# EAGLE design RP Sapling (EAGLE 9.5.2)
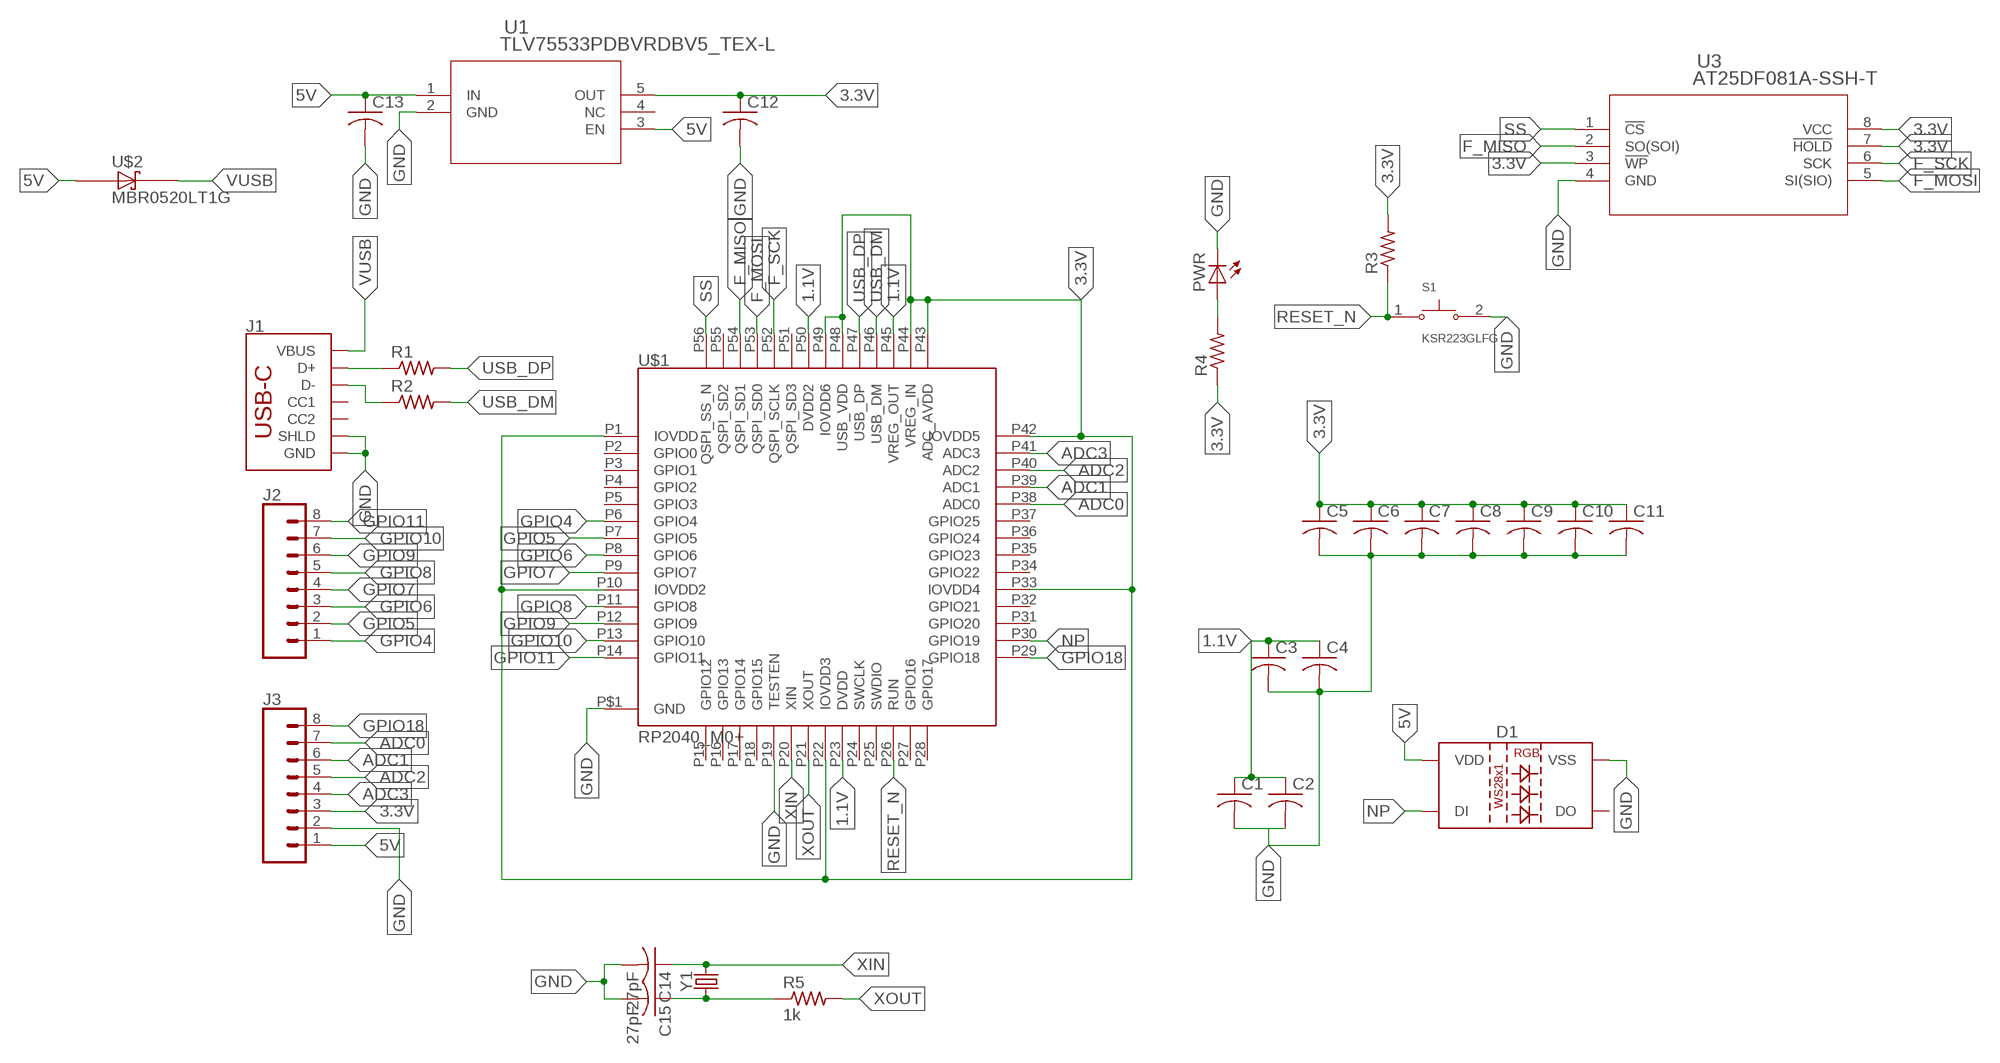
[diagram p0: schematic, sheet 1]

## Parts
C1  C-USC0402  [C0402]
C2  C-USC0402  [C0402]
C3  C-USC0402  [C0402]
C4  C-USC0402  [C0402]
C5  C-USC0402  [C0402]
C6  C-USC0402  [C0402]
C7  C-USC0402  [C0402]
C8  C-USC0402  [C0402]
C9  C-USC0402  [C0402]
C10  C-USC0402  [C0402]
C11  C-USC0402  [C0402]
C12  C-USC0402  [C0402]
C13  C-USC0402  [C0402]
C14  27pF  C-USC0402  [C0402]
C15  27pF  C-USC0402  [C0402]
D1  WS2812BWS2812B-1515  [WS2812B-1515]
J1  USB_C_2-LAYER  [USB-C-16P]
J2  CONN_08NO_SILK_DNP  [1X08_NO_SILK]
J3  CONN_08NO_SILK_DNP  [1X08_NO_SILK]
PWR  LEDCHIPLED_0805  [CHIPLED_0805]
R1  R-US_R0603  [R0603]
R2  R-US_R0603  [R0603]
R3  R-US_R0402  [R0402]
R4  R-US_R0603  [R0603]
R5  1k  R-US_R0402  [R0402]
S1  KSR223GLFG  [SW_KSR223GLFG]
U1  TLV75533PDBVRDBV5_TEX-L  [DBV5_TEX-L]
U3  AT25DF081A-SSH-T  [SOIC_AT25DF081_ADO]
U$1  RP2040_M0+  [QFN-56]
U$2  MBR0520LT1G  [SOD3716X117(SOD-123)]
Y1  CRYSTALSMD-5X3.2-2PAD  [CRYSTAL-SMD-5X3.2-2PAD]

## Nets
1.1V: C1.1 C2.1 C3.1 C4.1 U$1.P23(DVDD) U$1.P45(VREG_OUT) U$1.P50(DVDD2)
3.3V: C5.1 C6.1 C7.1 C8.1 C9.1 C10.1 C11.1 C12.1 J3.3 R3.2 R4.1 U1.5(OUT) U3.3(!WP) U3.7(!HOLD) U3.8(VCC) U$1.P1(IOVDD) U$1.P10(IOVDD2) U$1.P22(IOVDD3) U$1.P33(IOVDD4) U$1.P42(IOVDD5) U$1.P43(ADC_AVDD) U$1.P44(VREG_IN) U$1.P48(USB_VDD) U$1.P49(IOVDD6)
5V: C13.1 D1.VDD J3.1 U1.1(IN) U1.3(EN) U$2.2(A)
ADC0: J3.7 U$1.P38(ADC0)
ADC1: J3.6 U$1.P39(ADC1)
ADC2: J3.5 U$1.P40(ADC2)
ADC3: J3.4 U$1.P41(ADC3)
F_MISO: U3.2(SO(SOI)) U$1.P54(QSPI_SD1)
F_MOSI: U3.5(SI(SIO)) U$1.P53(QSPI_SD0)
F_SCK: U3.6(SCK) U$1.P52(QSPI_SCLK)
GND: C1.2 C2.2 C3.2 C4.2 C5.2 C6.2 C7.2 C8.2 C9.2 C10.2 C11.2 C12.2 C13.2 C14.2 C15.2 D1.GND(VSS) J1.GND J1.GND2(GND) J1.SHLD1(SHLD) J1.SHLD2(SHLD) J1.SHLD3(SHLD) J1.SHLD4(SHLD) J1.SHLD5(SHLD) J1.SHLD6(SHLD) J1.SHLD7(SHLD) J1.SHLD8(SHLD) J3.2 PWR.C S1.2 U1.2(GND) U3.4(GND) U$1.P19(TESTEN) U$1.P$1(GND)
GPIO4: J2.1 U$1.P6(GPIO4)
GPIO5: J2.2 U$1.P7(GPIO5)
GPIO6: J2.3 U$1.P8(GPIO6)
GPIO7: J2.4 U$1.P9(GPIO7)
GPIO8: J2.5 U$1.P11(GPIO8)
GPIO9: J2.6 U$1.P12(GPIO9)
GPIO10: J2.7 U$1.P13(GPIO10)
GPIO11: J2.8 U$1.P14(GPIO11)
GPIO18: J3.8 U$1.P29(GPIO18)
N$3: PWR.A R4.2
N$7: C15.1 R5.1 Y1.P$1
N$8: J1.A6(D+) J1.B6(D+) R1.1
N$9: J1.A7(D-) J1.B7(D-) R2.1
NP: D1.DIN(DI) U$1.P30(GPIO19)
RESET_N: R3.1 S1.1 U$1.P26(RUN)
SS: U3.1(!CS) U$1.P56(QSPI_SS_N)
USB_DM: R2.2 U$1.P46(USB_DM)
USB_DP: R1.2 U$1.P47(USB_DP)
VUSB: J1.VBUS1(VBUS) J1.VBUS2(VBUS) U$2.1(C)
XIN: C14.1 U$1.P20(XIN) Y1.P$2
XOUT: R5.2 U$1.P21(XOUT)
Unconnected: D1.DOUT(DO) J1.A5(CC1) J1.B5(CC2) U1.4(NC) U$1.P2(GPIO0) U$1.P3(GPIO1) U$1.P4(GPIO2) U$1.P5(GPIO3) U$1.P15(GPIO12) U$1.P16(GPIO13) U$1.P17(GPIO14) U$1.P18(GPIO15) U$1.P24(SWCLK) U$1.P25(SWDIO) U$1.P27(GPIO16) U$1.P28(GPIO17) U$1.P31(GPIO20) U$1.P32(GPIO21) U$1.P34(GPIO22) U$1.P35(GPIO23) U$1.P36(GPIO24) U$1.P37(GPIO25) U$1.P51(QSPI_SD3) U$1.P55(QSPI_SD2)

## Library data of the parts
C1-C15 = rcl:C-US: CAPACITOR, American symbol; SPICEPREFIX: C
D1 = SparkFun-LED:WS2812B: WS2812B SMD addressable RGB LED 5x5mm SMD LED with built-in controller IC. Color: Red/Green/Blue mC Rating: RGB: 390, 660, 180 mcd Forward Voltage: RGB: 2.0, 3.0, 3.0 V Packages:WS2812B SparkFun Products: Blynk Board - ESP8266 <https://www.sparkfun.com/products/13794>
J1 = SparkFun-Connectors:USB_C: USB Type C 16Pin Connector Super Speed pins not available on the 16-pin purely SMD connector so this part is best for USB 2.0 implementations. D1 and D2 are tied together enabling D+/- no matter which way the cable is plugged into the connector. The two channel configuration pins (CC1/2) are exposed. These are normally connected to ground via 5.1k resistors but can be reconfigured for high current/high power applications.; PROD_ID: CONN-14122
J2 J3 = SparkFun-Connectors:CONN_08: Multi connection point. Often used as Generic Header-pin footprint for 0.1 inch spaced/style header connections On any of the 0.1 inch spaced packages, you can populate with these: Break Away Headers - Straight <https://www.sparkfun.com/products/116> (PRT-00116) Break Away Male Headers - Right Angle <https://www.sparkfun.com/products/553> (PRT-00553) Female Headers <https://www.sparkfun.com/products/115> (PRT-00115) Break Away Headers - Machine Pin <https://www.sparkfun.com/products/117> (PRT-00117) Break Away Female Headers - Swiss Machine Pin <https://www.sparkfun.com/products/743> (PRT-00743) Arduino Stackable Header - 8 Pin <https://www.sparkfun.com/products/9279> (PRT-09279) For SCREWTERMINALS and SPRING TERMINALS visit here: Screw Terimnals on SparkFun.com <https://www.sparkfun.com/search/results?term=Screw+Terminals> (5mm/3.5mm/2.54mm spacing) This device is also useful as a general connection point to wire up your design to another part of your project. Our various solder wires solder well into these plated through hole pads. Hook-Up Wire - Assortment (Stranded, 22 AWG) <https://www.sparkfun.com/products/11375> (PRT-11375) Hook-Up Wire - Assortment (Solid Core, 22 AWG) <https://www.sparkfun.com/products/11367> (PRT-11367) View the entire wire category on our website here <https://www.sparkfun.com/categories/141> Special notes: Molex polarized connector foot print use with SKU : PRT-08231 with associated crimp pins and housings. 1MM SMD Version SKU: PRT-10208 NOTES ON THE VARIANTS LOCK and LOCK_LONGPADS... This footprint was designed to help hold the alignment of a through-hole component (i.e. 6-pin header) while soldering it into place. You may notice that each hole has been shifted either up or down by 0.005 of an inch from it's more standard position (which is a perfectly straight line). This slight alteration caused the pins (the squares in the middle) to touch the edges of the holes. Because they are alternating, it causes a "brace" to hold the component in place. 0.005 has proven to be the perfect amount of "off-center" position when using our standard breakaway headers. Although looks a little odd when you look at the bare footprint, once you have a header in there, the alteration is very hard to notice. Also,if you push a header all the way into place, it is covered up entirely on the bottom side.
PWR = adafruit:LED: LED OSRAM: - CHIPLED LG R971, LG N971, LY N971, LG Q971, LY Q971, LO R971, LY R971 LH N974, LH R974 LS Q976, LO Q976, LY Q976 LO Q996 - Hyper CHIPLED LW Q18S LB Q993, LB Q99A, LB R99A - SideLED LS A670, LO A670, LY A670, LG A670, LP A670 LB A673, LV A673, LT A673, LW A673 LH A674 LY A675 LS A676, LA A676, LO A676, LY A676, LW A676 LS A679, LY A679, LG A679 - Hyper Micro SIDELED® LS Y876, LA Y876, LO Y876, LY Y876 LT Y87S - SmartLED LW L88C, LW L88S LB L89C, LB L89S, LG L890 LS L89K, LO L89K, LY L89K LS L896, LA L896, LO L896, LY L896 - TOPLED LS T670, LO T670, LY T670, LG T670, LP T670 LSG T670, LSP T670, LSY T670, LOP T670, LYG T670 LG T671, LOG T671, LSG T671 LB T673, LV T673, LT T673, LW T673 LH T674 LS T676, LA T676, LO T676, LY T676, LB T676, LH T676, LSB T676, LW T676 LB T67C, LV T67C, LT T67C, LS T67K, LO T67K, LY T67K, LW E67C LS E67B, LA E67B, LO E67B, LY E67B, LB E67C, LV E67C, LT E67C LW T67C LS T679, LY T679, LG T679 LS T770, LO T770, LY T770, LG T770, LP T770 LB T773, LV T773, LT T773, LW T773 LH T774 LS E675, LA E675, LY E675, LS T675 LS T776, LA T776, LO T776, LY T776, LB T776 LHGB T686 LT T68C, LB T68C - Hyper Mini TOPLED® LB M676 - Mini TOPLED Santana® LG M470 LS M47K, LO M47K, LY M47K Source: http://www.osram.convergy.de/
R1-R5 = rcl:R-US_: RESISTOR, American symbol; SPICEPREFIX: R
S1 = KSR223GLFG:KSR223GLFG: Switch Tactile N.O. SPST Round Button Gull Wing 0.01A 32VDC 0.2VA 200000Cycles 2N SMD Automotive T/R; AVAILABILITY: Unavailable; DESCRIPTION: Tactile Switch SPST-NO Top Actuated Surface Mount; MF: C&K; MP: KSR223GLFG; PACKAGE: None; PRICE: None
U1 = TLV75533pdbvr:TLV75533PDBVR; COPYRIGHT: Copyright (C) 2018 Accelerated Designs. All rights reserved; MANUFACTURER_PART_NUMBER: TLV75533PDBVR; SOURCELIBRARY: TI_2019-06-18; VENDOR: Texas Instruments
U3 = AT25DF081A-SSH-T:AT25DF081A-SSH-T; BUILT_BY: EMA_Matt; COPYRIGHT: Copyright (C) 2018 Accelerated Designs. All rights reserved; MANUFACTURER_PART_NUMBER: AT25DF081A-SSH-T; SOURCELIBRARY: Adesto_Technologies_10-16-2019; VENDOR: Adesto Technologies
U$1 = RP2040_M0:RP2040_M0+
U$2 = MBR0520LT1G:MBR0520LT1G: Surface Mount Schottky Power Rectifier Plastic SOD−123 Package; AVAILABILITY: Unavailable; DESCRIPTION: Diode Schottky 20V 500mA Surface Mount SOD-123; MF: ON Semiconductor; MP: MBR0520LT1G; PACKAGE: SOD-123 ON Semiconductor; PRICE: None
Y1 = SparkFun-Clocks:CRYSTAL: Crystals (Generic) These are passive quartz crystals, which can be used as a clock source for a microcontroller. Crystal's are two-terminal devices. They require external "load" capacitors to generate an oscillating signal.

## Board
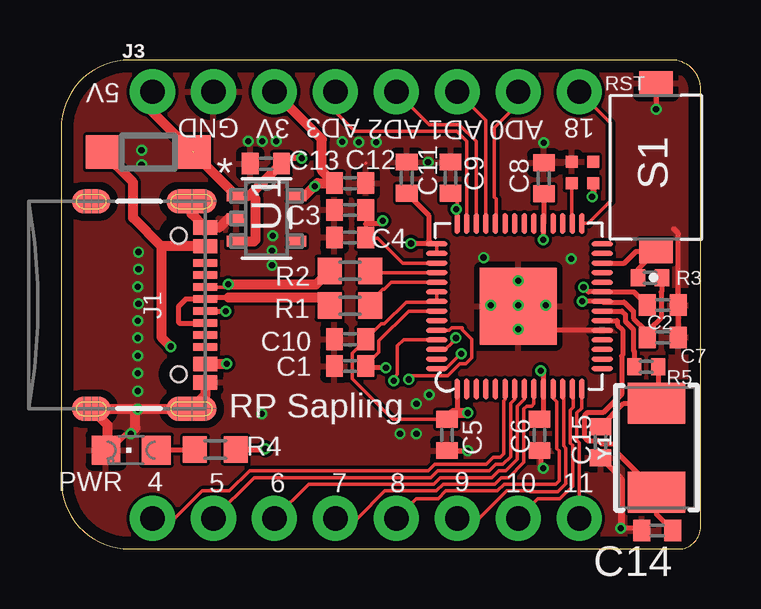
[diagram p1: board, top side]
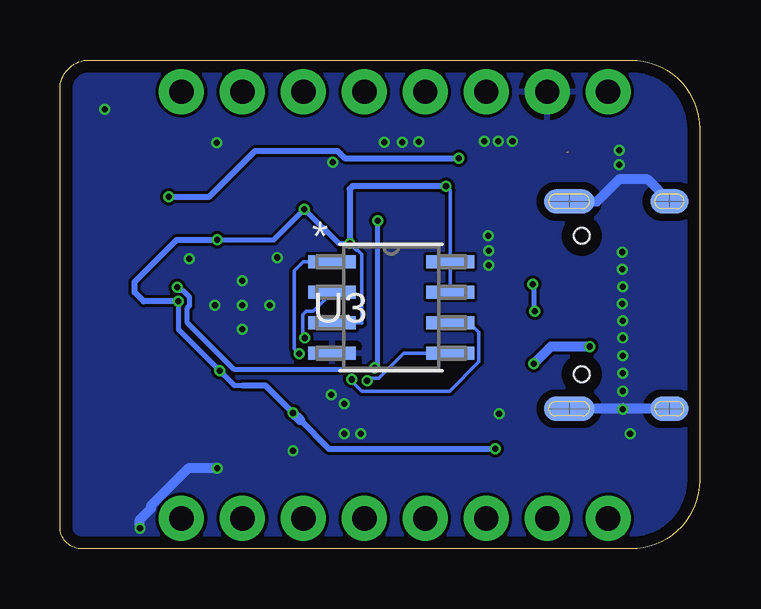
[diagram p2: board, bottom side, seen from below]

Size 26.65 x 20.37 mm. Coordinates in mm from the lower left corner, seen from the top.
Outline: 26.65,0.92 26.65,19.15 arc90 25.43,20.37 2.86,20.37 arc90 0,17.51 0,2.86 arc90 2.86,0 25.73,0 arc90 26.65,0.92
Copper layers (1*16): Top 0.035mm / dielectric 1.5mm / Bottom 0.035mm
Design rules "default *": minimum track width 6mil, minimum drill 10mil, track to track 5mil, track to pad 5mil, pad to pad 5mil, via to via 5mil, smd to smd 5mil, copper to edge 20mil, drill to drill 6mil, minimum pad ring 4mil, minimum via ring 4mil, stop-mask expansion 4mil, vias tented up to drill 10mil, thermal gap 10mil

### Footprints (pad centres in the part's own frame; a part is rotated, then mirrored left to right if it is on the bottom)
C0402 = smd 0.7 x 0.9: 1 -0.65,0; 2 0.65,0
WS2812B-1515 = smd 0.5 x 0.5: DIN -0.9,0.4; DOUT 0,1.3; GND -0.9,1.3; VDD 0,0.4
USB-C-16P = smd 0.3 x 1: A5 -1.25,-0.34; A6 -0.25,-0.34; A7 0.25,-0.34; A8 1.25,-0.34; B5 1.75,-0.34; B6 0.75,-0.34; B7 -0.75,-0.34; B8 -1.75,-0.34 | smd 0.6 x 1: GND -3.225,-0.34; GND2 3.225,-0.34; VBUS1 -2.45,-0.34; VBUS2 2.45,-0.34 | smd 1 x 2.1: SHLD1 -4.32,-0.915; SHLD2 4.32,-0.915 | smd 1 x 2.1 bottom: SHLD3 -4.32,-0.915; SHLD4 4.32,-0.915 | smd 1 x 1.6: SHLD5 -4.32,-5.095; SHLD8 4.32,-5.095 | smd 1 x 1.6 bottom: SHLD6 -4.32,-5.095; SHLD7 4.32,-5.095 | hole 0.65: -2.89,-1.445; 2.89,-1.445
1X08_NO_SILK = drill 1.016 pad 1.88: 1 0,0; 2 2.54,0; 3 5.08,0; 4 7.62,0; 5 10.16,0; 6 12.7,0; 7 15.24,0; 8 17.78,0
CHIPLED_0805 = smd 1.2 x 1.2: A 0,-1.05; C 0,1.05
R0603 = smd 1 x 1.1: 1 -0.85,0; 2 0.85,0
R0402 = smd 0.6 x 0.7: 1 -0.5,0; 2 0.5,0
SW_KSR223GLFG = smd 1 x 1.4: 1 -3.5,0; 2 3.5,0
DBV5_TEX-L = smd 0.775 x 0.457: 1 -1.264,0.95; 2 -1.264,0; 3 -1.264,-0.95; 4 1.264,-0.95; 5 1.264,0.95
SOIC_AT25DF081_ADO = smd 1.981 x 0.559: 1 -2.464,1.905; 2 -2.464,0.635; 3 -2.464,-0.635; 4 -2.464,-1.905; 5 2.464,-1.905; 6 2.464,-0.635; 7 2.464,0.635; 8 2.464,1.905
QFN-56 = smd 0.875 x 0.2: P1 -3.5,2.55; P2 -3.5,2.15; P3 -3.5,1.75; P4 -3.5,1.35; P5 -3.5,0.95; P6 -3.5,0.55; P7 -3.5,0.15; P8 -3.5,-0.25; P9 -3.5,-0.65; P10 -3.5,-1.05; P11 -3.5,-1.45; P12 -3.5,-1.85; P13 -3.5,-2.25; P14 -3.5,-2.65; P29 3.4,-2.65; P30 3.4,-2.25; P31 3.4,-1.85; P32 3.4,-1.45; P33 3.4,-1.05; P34 3.4,-0.65; P35 3.4,-0.25; P36 3.4,0.15; P37 3.4,0.55; P38 3.4,0.95; P39 3.4,1.35; P40 3.4,1.75; P41 3.4,2.15; P42 3.4,2.55 | smd 0.2 x 0.875: P15 -2.65,-3.5; P16 -2.25,-3.5; P17 -1.85,-3.5; P18 -1.45,-3.5; P19 -1.05,-3.5; P20 -0.65,-3.5; P21 -0.25,-3.5; P22 0.15,-3.5; P23 0.55,-3.5; P24 0.95,-3.5; P25 1.35,-3.5; P26 1.75,-3.5; P27 2.15,-3.5; P28 2.55,-3.5; P43 2.55,3.4; P44 2.15,3.4; P45 1.75,3.4; P46 1.35,3.4; P47 0.95,3.4; P48 0.55,3.4; P49 0.15,3.4; P50 -0.25,3.4; P51 -0.65,3.4; P52 -1.05,3.4; P53 -1.45,3.4; P54 -1.85,3.4; P55 -2.25,3.4; P56 -2.65,3.4 | smd 3.2 x 3.2: P$1 -0.05,0
SOD3716X117(SOD-123) = smd 1.4 x 1.4: 1 -1.9,0.051; 2 1.9,0.051
CRYSTAL-SMD-5X3.2-2PAD = smd 1.7 x 2.4: P$1 1.85,0; P$2 -1.85,0

### Placement (x,y rotation side)
C1  12.04,7.62 180 top
C2  25.07,10.16 0 top
C3  12.04,14.12 180 top
C4  12.04,12.98 180 top
C5  16.08,4.75 270 top
C6  19.94,4.75 270 top
C7  25.07,8.81 0 top
C8  20.12,15.44 90 top
C9  16.23,15.47 90 top
C10  12.04,8.74 180 top
C11  14.4,15.47 90 top
C12  12.04,15.24 0 top
C13  8.53,16.05 180 top
C14  24.84,0.76 180 top
C15  22.48,4.45 270 top
D1  22.17,14.83 0 top
J1  6.35,10.16 270 top
J2  3.81,1.27 0 top
J3  3.81,19.05 0 top
PWR  2.92,4.11 90 top
R1  12.04,10.13 0 top
R2  12.04,11.58 0 top
R3  24.54,11.3 0 top
R4  6.43,4.14 180 top
R5  24.38,7.59 180 top
S1  24.79,15.9 90 top
U1  8.56,13.77 0 top
U3  12.85,10.06 0 bottom
U$1  19.05,10.16 90 top
U$2  3.63,16.48 0 top
Y1  24.82,4.22 90 top

### Tracks (layer width: path | path; a pad name or v marks a point on that pad's centre or on a via)
1.1V  (via drill 0.25)
  Top 0.152: C1.1 12.69,7.65 13.24,8.2 13.24,8.67 14.48,9.91 U$1.P50 | U$1.P45 14.23,11.91 13.2,12.93 12.69,12.93 | C3.1 12.69,13.54 C4.1
  Top 0.203: 12.69,12.93 C4.1 | C2.1 23.87,10.71 U$1.P23 21.97,10.71 21.91,10.77 21.89,10.77 v21.77,10.9 | v13.54,7.54 12.77,7.54 C1.1 | v13.41,13.66 13.28,13.54 12.69,13.54
  Bottom 0.203: v21.77,10.9 21.64,10.77 21.53,10.77 21.26,10.5 21.26,10.12 21.36,10.02 21.36,9.45 19.41,7.49 13.59,7.49 v13.54,7.54 13.41,7.67 v13.41,13.66
3.3V  (via drill 0.25)
  Top 0.152: U$1.P48 U$1.P49 15.63,10.29 14.38,10.29 13.47,9.38 13.33,9.38 C10.1 12.69,8.71 12.14,8.15 12.14,7.09 13.82,5.4 C5.1 | C9.1 16.5,14.55 16.5,14.17 U$1.P42 | U$1.P44 U$1.P43
  Top 0.203: C9.1 16.25,14.8 | 20.12,14.55 C8.1 20.12,13.58 U$1.P33 v20.1,12.89 v20.09,12.88 | C6.1 20.1,5.56 U$1.P10 20.1,7.31 v19.99,7.42 | R3.2 25.04,10.74 25,10.7 25,9.62 24.51,9.12 | C7.1 24.42,9.04 24.51,9.12 | 24.51,9.12 24.33,9.12 23.84,9.62 23.84,9.91 23.46,10.29 22.57,10.29 U$1.P22 v21.72,10.31 | C11.1 15.32,13.9 15.32,12.84 15.45,12.71 U$1.P43 15.63,12.72 v14.58,12.72 | 16.5,14.17 v16.48,14.15 v16.47,14.15 | U$1.P1 16.5,5.68 16.48,5.66 | v10.57,15.11 10.69,15.24 C12.1
  Top 0.254: v8.51,4.17 8.48,4.14 R4.1
  Top 0.406: U1.5 10.15,14.72 10.68,15.24 C12.1 10.87,15.76 10.87,17.07 J3.3 | C5.1 16.34,5.66 16.48,5.66 v16.94,5.66
  Bottom 0.152: U3.3 14.1,9.42 14.07,9.4 14.07,12.28 14.24,12.45 14.3,12.45 v14.58,12.72 | U3.7 U3.8 10.39,14.94 v10.57,15.11
  Bottom 0.203: 19.05,6.82 19.39,6.82 v19.99,7.42 21.72,9.14 v21.72,10.31 | v14.58,12.72 15.05,12.72 v16.47,14.15 17.74,12.88 v20.09,12.88
  Bottom 0.254: v21.72,10.31 23.16,10.31 23.55,10.69 23.55,11.12 21.79,12.88 v20.09,12.88 | v10.57,15.11 14.45,15.11 14.58,14.99 v14.58,12.72 | 19.05,6.82 18.1,6.82 v16.94,5.66 | v8.51,4.17 15.44,4.17 16.65,5.37
  Bottom 0.406: 16.65,5.37 v16.94,5.66
5V  (via drill 0.25)  (1 unrouted)
  Top 0.254: 9.29,15.94 C13.1 9.41,16.28 v10.03,16.28 | D1.VDD 22.17,14.73 v22.12,14.68
  Top 0.406: 7.91,14.78 7.85,14.72 U1.1 5.48,16.54 U$2.2 | 7.91,14.78 C13.1 | U1.3 8.04,12.82 8.1,12.88 8.1,14.58 7.91,14.78 | 5.47,16.54 3.81,18.2 J3.1
  Bottom 0.254: v22.12,14.68 20.42,14.68 18.52,16.59 15.09,16.59 14.79,16.28 v10.03,16.28
ADC0
  Top 0.152: J3.7 19.05,18.54 18.06,17.55 18.06,14.66 18.14,14.58 18.14,13.6 U$1.P38
ADC1
  Top 0.152: J3.6 17.7,17.86 U$1.P39
ADC2
  Top 0.152: J3.5 15.34,17.68 16.6,17.68 17.3,16.98 U$1.P40
ADC3
  Top 0.152: U$1.P41 16.9,16.98 16.48,17.4 12.24,17.4 11.43,18.21 J3.4
F_MISO  (via drill 0.25)
  Top 0.152: v16.45,8.79 16.29,8.62 16.29,8.58 16.02,8.31 U$1.P54
  Bottom 0.152: U3.2 16.1,9.91 16.39,9.91 16.54,9.76 16.54,8.87 v16.45,8.79
F_MOSI  (via drill 0.25)
  Top 0.152: U$1.P53 14.27,8.71 14.02,8.46 14.02,7.27 13.86,7.11 v13.86,7.01
  Bottom 0.152: v13.86,7.01 13.86,7.11 13.36,7.11 12.32,8.15 U3.5
F_SCK  (via drill 0.25)
  Top 0.152: v14.49,7.06 14.64,7.21 16.11,7.21 16.61,7.71 16.86,7.71 17.11,7.96 17.11,8.74 16.71,9.14 16.71,9.22 16.27,9.22 16.16,9.11 U$1.P52
  Bottom 0.152: U3.6 9.59,9.42 9.2,9.03 9.2,7.79 10.41,6.58 14.09,6.58 14.49,6.98 v14.49,7.06
GND  (via drill 0.25)  (2 unrouted)
  Top 0.152: D1.GND 21.23,16.09 | C9.2 16.18,16.17 | 14.4,16.26 C11.2 | 12.69,16.07 12.7,16.08 | C10.2 11.36,8.76
  Top 0.203: C5.2 v16.93,4.1 v16.94,4.09 | v20.09,3.35 19.98,3.47 19.98,4.06 C6.2 | C2.2 25.7,10.18 | C2.2 C7.2 | S1.2 v24.79,18.31 | PWR.C 1.93,4.17 2.17,4.42 2.34,4.42 2.72,4.8 v2.9,4.8 | C14.2 24.09,0.86 v23.32,0.86 | U$1.P19 20.1,9.11 v19.05,10.16 | v23.32,0.86 23.39,0.94 23.39,1.42 23.39,2.89 C15.2 23.32,2.96 v23.32,0.86 | C13.2 7.68,16.26 | C2.2 25.72,13.14 25.53,13.34
  Top 0.406: J1.SHLD3 5.43,13.96 J1.GND 6.58,13.38 6.97,13.77 U1.2 | J1.GND2 6.01,6.42 J1.SHLD4 3.12,5.84 | 3.12,5.84 J1.SHLD8 1.93,5.17 1.93,4.17 | v2.9,4.8 2.9,4.83 3.09,5.03 3.09,5.81 3.12,5.84
  Bottom 0.152: 3.17,5.84 3.17,6.03 v3.2,5.82
  Bottom 0.406: v20.09,3.35 21.3,3.35 22.86,1.8 22.86,1.68 23.32,1.22 v23.32,0.86 | J1.SHLD3 4.26,14.48 3.35,15.39 2.17,15.39 J1.SHLD6 | J1.SHLD8 3.17,5.84 J1.SHLD4
  other vias: 19.05,9.14 20.19,10.16 17.91,10.16 19.05,11.18 15.29,16.1 20.12,16.92 14.81,6.05 15.34,6.43 13.13,16.94 12.4,16.94 11.71,16.97 8.97,16.99 8.38,16.99 7.8,16.99 3.35,16.61 3.35,16 3.23,12.37 3.23,11.66 3.2,10.92 3.23,10.21 3.2,9.5 3.2,8.79 3.2,8.05 3.2,7.32 3.2,6.58 14.81,4.8 14.12,4.8 17.6,12.14 21.26,12.09 8.81,13.06 8.79,12.42 8.79,11.81 8.36,5.64
  pour Top: -1.27,21.64 27.94,21.64 27.94,-1.27 -1.27,-1.27
  pour Bottom: -2.54,22.86 29.21,22.86 29.21,-2.54 -2.54,-2.54
GPIO4
  Top 0.152: U$1.P6 18.5,6.23 18.45,6.18 18.45,3.96 18.3,3.81 18,3.81 17.72,3.53 15.57,3.53 15.29,3.25 7.86,3.25 7.02,2.41 5.88,2.41 4.73,1.27 J2.1
GPIO5
  Top 0.152: U$1.P7 18.9,6.24 18.73,6.07 18.73,3.85 18.41,3.53 18.11,3.53 17.83,3.25 15.69,3.25 15.41,2.97 8.05,2.97 J2.2
GPIO6
  Top 0.152: U$1.P8 19.3,6.24 19.01,5.95 19.01,3.73 18.53,3.25 18.23,3.25 17.95,2.97 15.8,2.97 15.53,2.69 10.31,2.69 J2.3
GPIO7
  Top 0.152: U$1.P9 19.7,6.04 19.61,5.95 19.41,5.95 19.29,5.83 19.29,3.61 18.64,2.97 18.34,2.97 18.07,2.69 15.92,2.69 15.64,2.41 13.5,2.41 12.35,1.27 J2.4
GPIO8
  Top 0.152: U$1.P11 20.5,6.3 20.66,6.14 20.66,4.18 20.75,4.08 20.75,2.84 20.61,2.69 18.46,2.69 18.18,2.41 16.04,2.41 15.72,2.1 14.8,2.1 J2.5
GPIO9
  Top 0.152: U$1.P12 20.94,6.62 20.94,4.29 21.03,4.2 21.03,2.72 20.7,2.39 19.55,2.39 19.52,2.41 18.58,2.41 17.43,1.27 J2.6
GPIO10
  Top 0.152: J2.7 19.86,2.08 20.79,2.08 21.31,2.61 21.31,4.31 21.22,4.41 21.22,5.78 21.33,5.9 21.33,6.63 U$1.P13
GPIO11
  Top 0.152: U$1.P14 21.7,5.87 21.5,5.67 21.5,4.52 21.59,4.43 J2.8
GPIO18
  Top 0.152: J3.8 22.89,17.75 22.89,14.48 21.97,13.56 U$1.P29
N$3
  Top 0.203: PWR.A 4,4.14 R4.2
N$7
  Top 0.203: C15.1 23.45,6.07 Y1.P$1 24.88,6.13 R5.1
N$8
  Top 0.203: 6.99,10.47 6.07,10.47 J1.A6 5.21,10.41 4.89,10.1 4.89,9.46 4.95,9.4 6,9.4 J1.B6
  Top 0.406: R1.1 10.86,10.47 6.99,10.47
N$9  (via drill 0.25)
  Top 0.152: J1.B7 6.85,10.91 v6.96,11.02 | v6.96,11.03 6.99,11.11 6.99,11.02
  Top 0.203: J1.A7 v6.87,9.91 | 6,10.92 J1.B7
  Top 0.406: v6.96,11.02 6.99,11.02 10.63,11.02 R2.1
  Bottom 0.203: v6.87,9.91 6.88,9.93 6.88,10.95 v6.96,11.03
NP
  Top 0.152: D1.DIN 21.27,13.59 U$1.P30
RESET_N
  Top 0.203: U$1.P26 23.47,11.91 23.96,12.4 S1.1 24.04,11.65 R3.1
SS  (via drill 0.25)
  Top 0.152: U$1.P56 16.02,7.51 16.66,8.15 v16.68,8.14
  Bottom 0.152: v16.68,8.14 16.89,8.35 16.89,11.58 16.51,11.96 U3.1
USB_DM
  Top 0.152: 13.09,11.38 R2.2 12.97,11.51 14.94,11.51 U$1.P46
USB_DP
  Top 0.152: R1.2 12.89,10.32 13.39,10.83 13.47,10.83 13.76,11.11 U$1.P47
VUSB  (via drill 0.25)
  Top 0.406: J1.VBUS1 4.18,12.61 | U$2.1 3,15.27 3,13.79 4.18,12.61 | J1.VBUS2 6.9,7.71 v6.91,7.72 | 4.18,12.61 4.18,8.82 v4.57,8.43
  Bottom 0.406: v4.57,8.43 6.2,8.43 v6.91,7.72
XIN
  Top 0.203: C14.1 24.82,1.44 Y1.P$2 23.16,4.03 23.16,4.24 23.02,4.37 22.52,4.37 22.38,4.52 21.93,4.52 21.8,4.65 21.8,5.54 21.93,5.67 22.59,5.67 23.36,6.44 23.36,8.04 23.39,8.08 23.39,9.13 23.18,9.34 23.18,9.5 23.17,9.51 U$1.P20
XOUT
  Top 0.203: 22.95,9.91 U$1.P21 23.37,9.91 23.51,9.77 23.51,9.48 23.84,9.15 23.84,8.27 23.88,8.23 R5.2

### Text on the board
tNames: 5V | RST | GND | 3V | AD3 | AD2 | AD1 | AD0 | 18 | RP Sapling | 4 | 5 | 6 | 7 | 8 | 9 | 10 | 11